# Altium project FuenteE2.PrjPcb
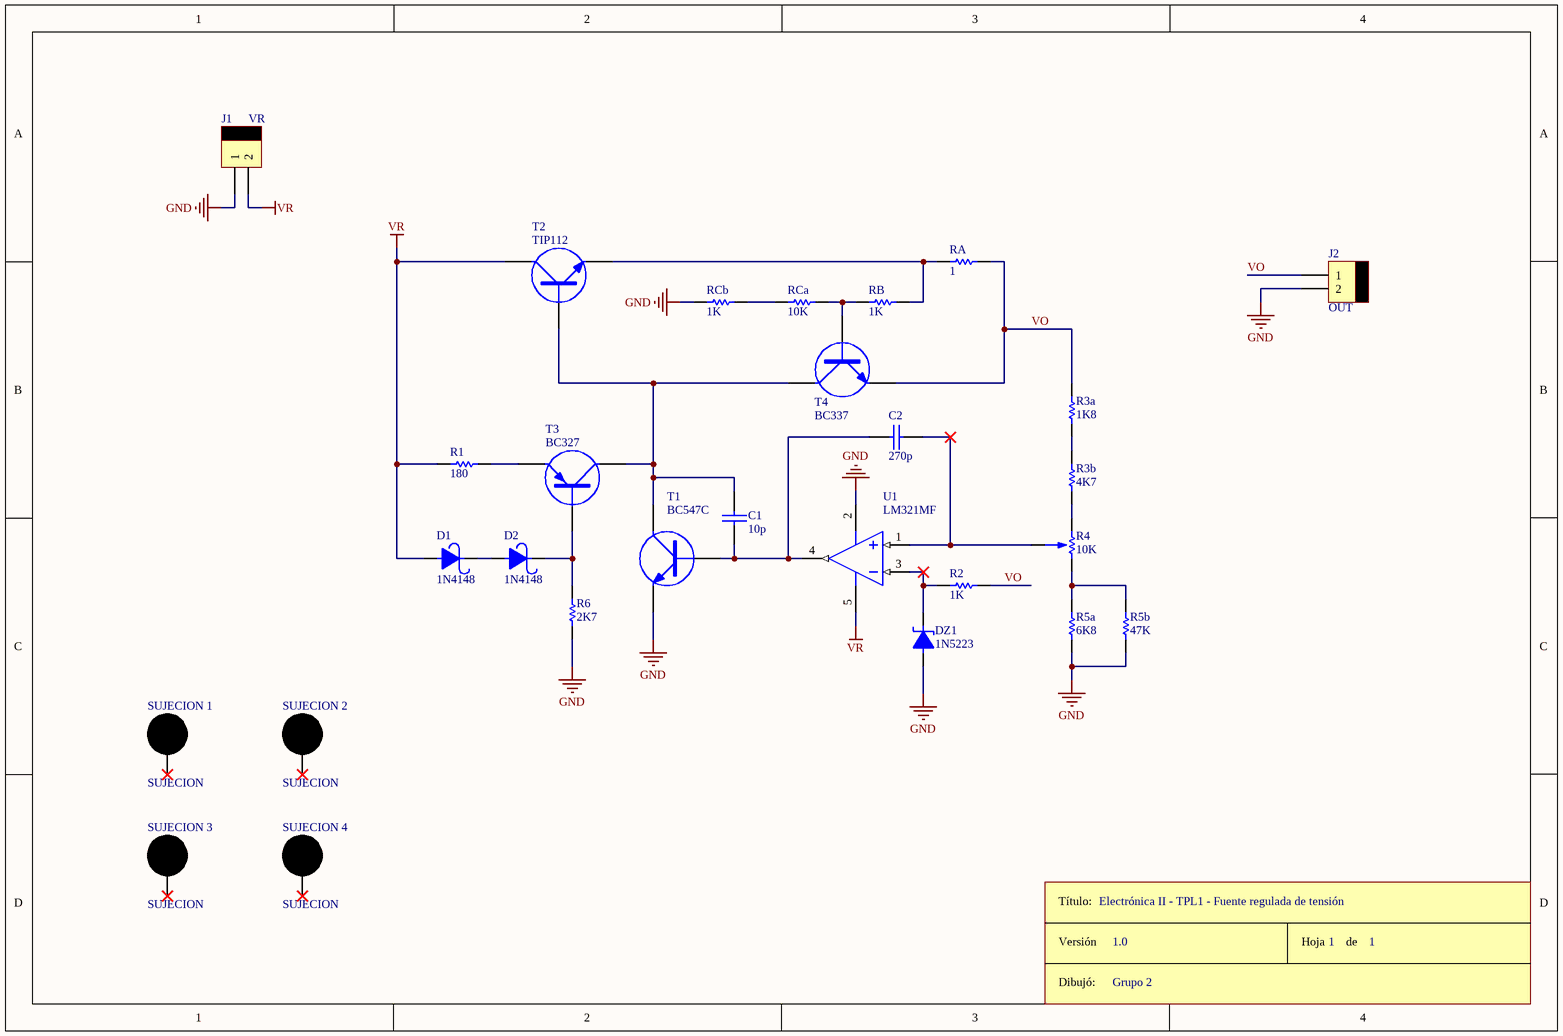
[diagram p0: Esquematico.SchDoc]
1 sheet, 29 parts. Net scope: global (net labels, ports and power ports of the same name join across sheets).
Board file: Placa.PcbDoc

## Sheet Esquematico.SchDoc
size A4

### Parts
C1  10p  [CAP100]
C2  270p  [CAP100]
D1  1N4148  [DO41]
D2  1N4148  [DO41]
DZ1  1N5223  [DO41]
J1  VR  [MOLEX2]
J2  OUT  [MOLEX2]
R1  180  [RES300]
R2  1K  [RES300]
R3a  1K8  [RES300]
R3b  4K7  [RES300]
R4  10K  [POTENCIOMETRO]
R5a  6K8  [RES300]
R5b  47K  [RES300]
R6  2K7  [RES300]
RA  1  [RES600]
RB  1K  [RES300]
RCa  10K  [RES300]
RCb  1K  [RES300]
ROT1  Rótulo  (value not drawn)
SUJECION_1  SUJECION  [SUJECION (5.00MM - 3.50MM)]
SUJECION_2  SUJECION  [SUJECION (5.00MM - 3.50MM)]
SUJECION_3  SUJECION  [SUJECION (5.00MM - 3.50MM)]
SUJECION_4  SUJECION  [SUJECION (5.00MM - 3.50MM)]
T1  BC547C  [TO92]
T2  TIP112  [TO-220 V]
T3  BC327  [TO92]
T4  BC337  [TO92]
U1  LM321MF  [MF05A_N]

### Nets
GND: DZ1.1 J1.1 J2.2 R5a.1 R5b.1 R6.1 RCb.1 T1.3(E) U1.2(V-)
VR: D1.1 J1.2 R1.1 T2.2(C) U1.5(V+)
VO: J2.1 R2.1 R3a.2 RA.2 T4.3(E)
NetC1_1: C1.1 T1.2(C) T2.1(B) T3.2(C) T4.2(C)
NetC1_2: C1.2 C2.1 T1.1(B) U1.4(OUT)
NetC2_2: C2.2 R4.2 U1.1(IN+)
NetD1_2: D1.2 D2.1
NetD2_2: D2.2 R6.2 T3.1(B)
NetDZ1_2: DZ1.2 R2.2 U1.3(IN-)
NetR1_2: R1.2 T3.3(E)
NetR3a_1: R3a.1 R3b.2
NetR3b_1: R3b.1 R4.3
NetR4_1: R4.1 R5a.2 R5b.2
NetRA_1: RA.1 RB.2 T2.3(E)
NetRB_1: RB.1 RCa.2 T4.1(B)
NetRCa_1: RCa.1 RCb.2

Not connected (* = marked no-connect by the designer): SUJECION_1 1*; SUJECION_2 1*; SUJECION_3 1*; SUJECION_4 1*

### Notes on the sheet
- Electrónica II - TPL1 - Fuente regulada de tensión
- 1.0
- Grupo 2
- 1
- (in symbol Rótulo) Título:; Versión; Hoja       de; Dibujó:

### Library data of the parts
C1 C2 = CAP
D1 D2 = DIODO SCHOTTKY
DZ1 = DIODO ZENER
J1 J2 = MOLEX2
R1 R2 R3a R3b R5a R5b R6 RA RB RCa RCb = RES
R4 = POTENCIOMETRO
T1 T2 T4 = TRANSISTOR NPN
T3 = TRANSISTOR PNP
U1 = LM321MF: Low Power Single Op Amp; Manufacturer: National Semiconductor; CompType: Amplifiers; PackageTopMarking: A63A*XTT; PowerWise: N; Published: 4-Dec-2008; LatestRevisionDate: 13-Jan-2009; LatestRevisionNote: Sim Model Added.; DatasheetVersion: Apr-2001; PackageVersion: revD, Aug-2008; PackageReference: MF05A; Publisher: Altium Limited; PackageDescription: Molded SOT-23, .115 x .063 x .040 in Body, 5 Lead, .0375 in Pitch; PartNumber: LM321MF; RoHS: O; PinCount: 5; DigiKeyPartNumber: LM321MFCT-ND; Code_IPC: SOT23-5; ComponentLink1Description: LM321 Datasheet; ComponentLink1URL: http://www.national.com/ds/LM/LM321.pdf; ComponentLink2Description: LM321 Web Page; ComponentLink2URL: http://www.national.com/pf/LM/LM321.html; ComponentLink3Description: MF05A Package Page; ComponentLink3URL: http://www.national.com/packaging/folders/mf05a.html